# Altium schematic sheet Buzzer.SchDoc
size A4
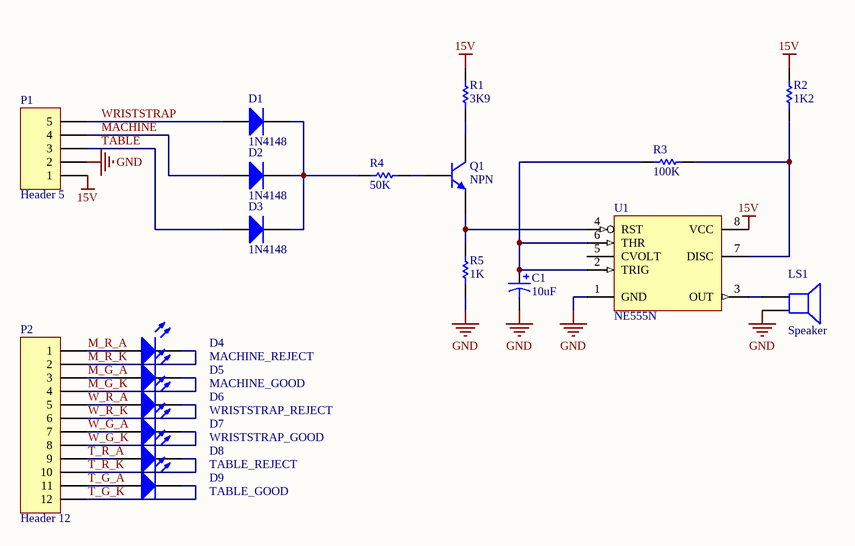
[diagram p0: Buzzer.SchDoc]

## Parts
C1  10uF  [E2,5-5]
D1  1N4148  [DO34Z7]
D2  1N4148  [DO34Z7]
D3  1N4148  [DO34Z7]
D4  MACHINE_REJECT  [LED5MM]
D5  MACHINE_GOOD  [LED5MM]
D6  WRISTSTRAP_REJECT  [LED5MM]
D7  WRISTSTRAP_GOOD  [LED5MM]
D8  TABLE_REJECT  [LED5MM]
D9  TABLE_GOOD  [LED5MM]
LS1  Speaker  [BUZZER-16MM]
P1  Header 5  [7395-05]
P2  Header 12  [7395-12]
Q1  NPN  [TO92]
R1  3K9  [0207/10]
R2  1K2  [0207/10]
R3  100K  [0207/10]
R4  50K  [0207/10]
R5  1K  [0207/10]
U1  NE555N  [DIP8]

## Nets
15V: P1.1 R1.2 R2.2 U1.8(VCC)
GND: C1.2 LS1.2 P1.2 R5.1 U1.1(GND)
M_G_A: D5.1(A) P2.3
M_G_K: D5.2(K) P2.4
M_R_A: D4.1(A) P2.1
M_R_K: D4.2(K) P2.2
MACHINE: D2.1(A) P1.4
T_G_A: D9.1(A) P2.11
T_G_K: D9.2(K) P2.12
T_R_A: D8.1(A) P2.9
T_R_K: D8.2(K) P2.10
TABLE: D3.1(A) P1.3
W_G_A: D7.1(A) P2.7
W_G_K: D7.2(K) P2.8
W_R_A: D6.1(A) P2.5
W_R_K: D6.2(K) P2.6
WRISTSTRAP: D1.1(A) P1.5
NetC1_1: C1.1 R3.1 U1.2(TRIG) U1.6(THR)
NetD1_2: D1.2(K) D2.2(K) D3.2(K) R4.1
NetLS1_1: LS1.1 U1.3(OUT)
NetQ1_1: Q1.1(C) R1.1
NetQ1_2: Q1.2(B) R4.2
NetQ1_3: Q1.3(E) R5.2 U1.4(RST)
NetR2_1: R2.1 R3.2 U1.7(DISC)

Not connected (* = marked no-connect by the designer): U1 5(CVOLT)

## Notes on the sheet
- Title
- Size:
- Date:
- A4
- Number:
- Time:
- Revision:
- Sheet
- of
- File:

## Library data of the parts
C1 = Cap Pol1: Polarized Capacitor (Radial); Published: 8-Jun-2000; LatestRevisionDate: 17-Jul-2002; LatestRevisionNote: Re-released for DXP Platform.; PackageReference: RB7.6-15; Publisher: Altium Limited; PackageDescription: Polarized Capacitor (Radial); 2 Leads; Value: 10uF
D1-D3 = Diode: Default Diode; Published: 8-Jun-2000; LatestRevisionDate: 17-Jul-2002; LatestRevisionNote: Re-released for DXP Platform.; PackageVersion: Sep-1996; PackageReference: SMC; Publisher: Altium Limited; PackageDescription: DO-214-AB/SMC; 2 C-Bend Leads; Body 7.9 x 5.9 mm, inc. leads (LxW); Code_JEDEC: DO-214-AB
D4-D9 = LED0: Typical INFRARED GaAs LED; Published: 8-Jun-2000; LatestRevisionDate: 08-Jul-2005; LatestRevisionNote: Mech Layer 1 removed.; PackageReference: LED-0; Publisher: Altium Limited; PackageDescription: LED; 2 Leads
LS1 = Speaker: Loudspeaker; Published: 24-Mar-1999; LatestRevisionDate: 17-Jul-2002; LatestRevisionNote: Re-released for DXP Platform.; PackageReference: PIN2; Publisher: Altium Limited
P1 = Header 5: Header, 5-Pin; LatestRevisionDate: 17-Jul-2002; LatestRevisionNote: Re-released for DXP Platform.; Publisher: Altium Limited
P2 = Header 12: Header, 12-Pin; LatestRevisionDate: 17-Jul-2002; LatestRevisionNote: Re-released for DXP Platform.; Publisher: Altium Limited
Q1 = NPN: NPN Bipolar Transistor; Published: 8-Jun-2000; LatestRevisionDate: 17-Jul-2002; LatestRevisionNote: Re-released for DXP Platform.; PackageReference: TO-226-AA; Publisher: Altium Limited; PackageDescription: TO, Flat Index; 3 In-Line, Axial Leads; Body Dia. 4.8mm; Leads 0.55 x 0.51 mm (max); Code_JEDEC: TO-226-AA
R1-R5 = Res1: Resistor; Published: 8-Jun-2000; LatestRevisionDate: 17-Jul-2002; LatestRevisionNote: Re-released for DXP Platform.; PackageReference: AXIAL-0.3; Publisher: Altium Limited; PackageDescription: Axial Device, Thru-Hole; 2 Leads; 0.3 in Pin Spacing
  R1: Value: 3K9
  R2: Value: 1K2
  R3: Value: 100K
  R4: Value: 50K
  R5: Value: 1K
U1 = NE555N: General-Purpose Single Bipolar Timer; Published: 24-Aug-2001; LatestRevisionDate: 06-Jun-2005; LatestRevisionNote: Stylized 3D Model Added.; DatasheetVersion: Jul-1998; PackageReference: DIP8; Publisher: Altium Limited; PackageDescription: DIP; 8 Leads; Row Spacing 7.62 mm; Pitch 2.54 mm; Code_JEDEC: MO-001-AN; ComponentLink1Description: Manufacturer Link; ComponentLink1URL: http://www.st.com/; ComponentLink2Description: Datasheet; ComponentLink2URL: http://www.st.com/stonline/products/literature/ds/2182/ne555.pdf